# Altium schematic sheet 电源设计.SchDoc
size A4; Organization: Protel International P/L; Address1: L3, 12a Rodborough Rd; Address2: Frenchs Forest; Address3: NSW; Address4: Australia 2086
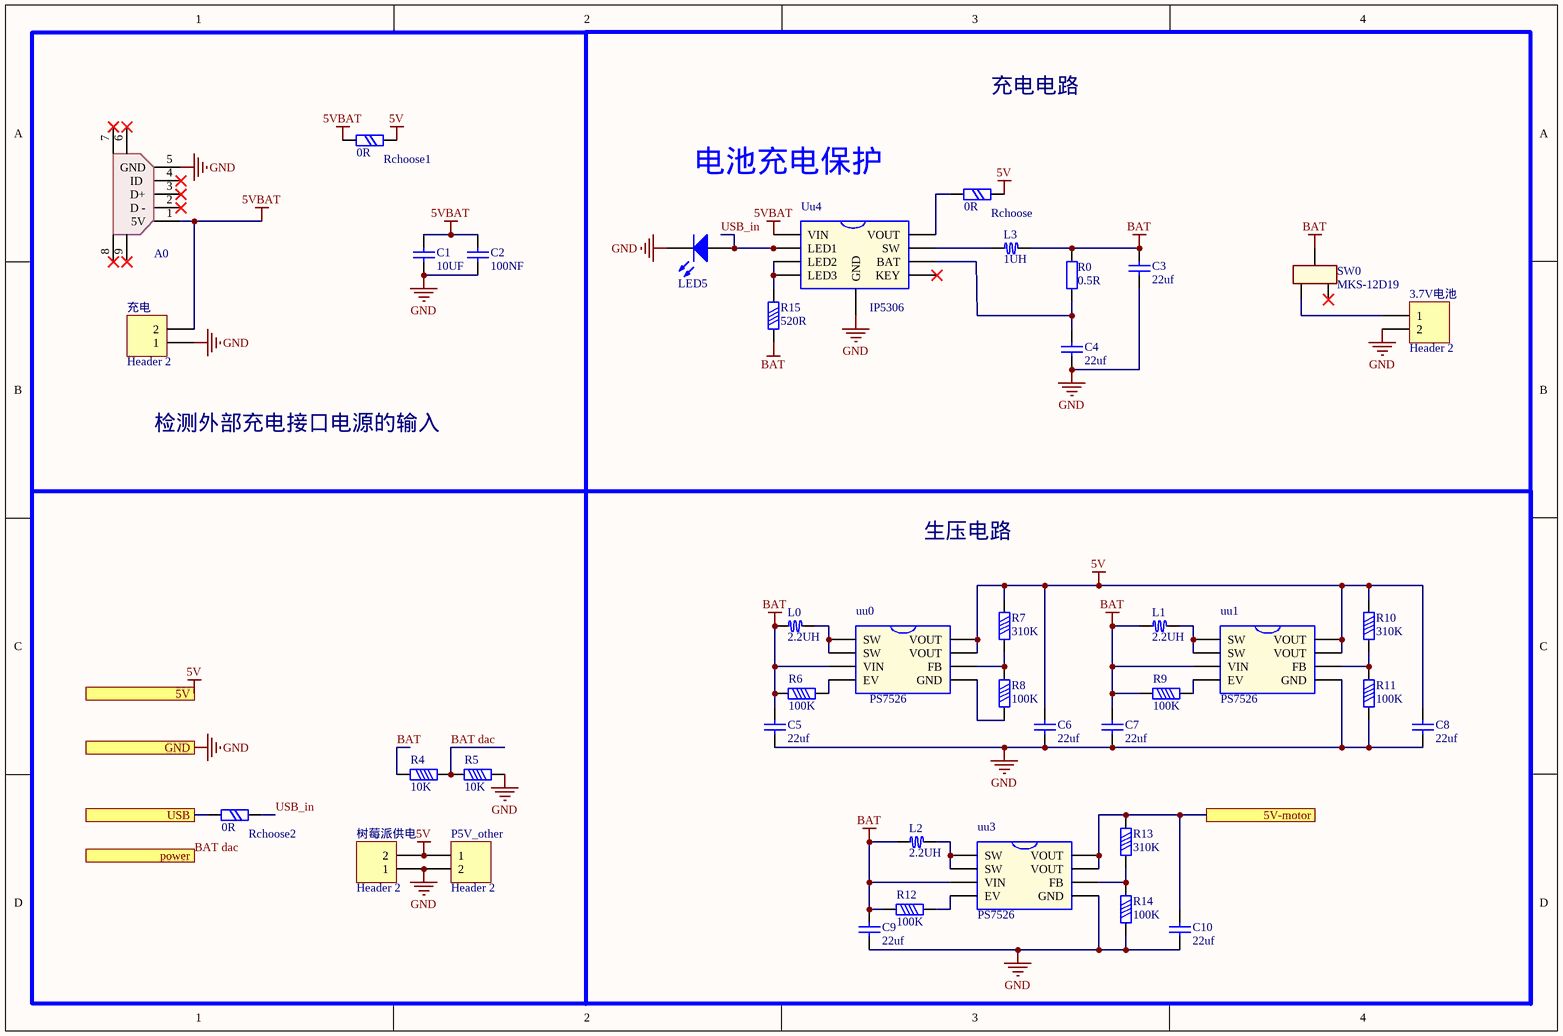
[diagram p0: 电源设计.SchDoc]

## Parts
3.7V电池  Header 2  [HX2.54-2]
A0  Micro USB  [Micro USB]  (value not drawn)
C1  value 10UF  [CC2012-0805]  (hidden comment: Cap Chip 0805)
C2  value 100NF  [CC2012-0805]  (hidden comment: Cap Chip 0805)
C3  value 22uf  [CC2012-0805]  (hidden comment: Cap Chip 0805)
C4  value 22uf  [CC2012-0805]  (hidden comment: Cap Chip 0805)
C5  value 22uf  [CC2012-0805]  (hidden comment: Cap Chip 0805)
C6  value 22uf  [CC2012-0805]  (hidden comment: Cap Chip 0805)
C7  value 22uf  [CC2012-0805]  (hidden comment: Cap Chip 0805)
C8  value 22uf  [CC2012-0805]  (hidden comment: Cap Chip 0805)
C9  value 22uf  [CC2012-0805]  (hidden comment: Cap Chip 0805)
C10  value 22uf  [CC2012-0805]  (hidden comment: Cap Chip 0805)
L0  2.2UH  [Inductor-1040]
L1  2.2UH  [Inductor-1040]
L2  2.2UH  [Inductor-1040]
L3  1UH  [Inductor-1040]
LED5  LED Chip  [CLED1608-0603]  (value not drawn)
P5V_other  Header 2  [HDR1X2]
R0  value 0.5R  [CR2012-0805]  (hidden comment: Resistor Chip 0805)
R4  value 10K  [CR1608-0603]  (hidden comment: Resistor Chip 0603)
R5  value 10K  [CR1608-0603]  (hidden comment: Resistor Chip 0603)
R6  value 100K  [CR1608-0603]  (hidden comment: Resistor Chip 0603)
R7  value 310K  [CR1608-0603]  (hidden comment: Resistor Chip 0603)
R8  value 100K  [CR1608-0603]  (hidden comment: Resistor Chip 0603)
R9  value 100K  [CR1608-0603]  (hidden comment: Resistor Chip 0603)
R10  value 310K  [CR1608-0603]  (hidden comment: Resistor Chip 0603)
R11  value 100K  [CR1608-0603]  (hidden comment: Resistor Chip 0603)
R12  value 100K  [CR1608-0603]  (hidden comment: Resistor Chip 0603)
R13  value 310K  [CR1608-0603]  (hidden comment: Resistor Chip 0603)
R14  value 100K  [CR1608-0603]  (hidden comment: Resistor Chip 0603)
R15  value 520R  [CR1608-0603]  (hidden comment: Resistor Chip 0603)
Rchoose  value 0R  [CR3216-1206]  (hidden comment: Resistor Chip 1206)
Rchoose1  value 0R  [CR3216-1206]  (hidden comment: Resistor Chip 1206)
Rchoose2  value 0R  [CR3216-1206]  (hidden comment: Resistor Chip 1206)
SW0  MKS-12D19  [SW  MKS 12D19]
uu0  PS7526  [ESOP8]
uu1  PS7526  [ESOP8]
uu3  PS7526  [ESOP8]
Uu4  IP5306  [ESOP8]
充电  Header 2  [HX2.54-2]
树莓派供电  Header 2  [HX2.54-2]

## Ports
5V, 5V-motor, GND, power, USB

## Nets
5V: C6.1 C8.1 P5V_other.1 R7.1 R10.1 Rchoose.2 Rchoose1.2 uu0.7(VOUT) uu0.8(VOUT) uu1.7(VOUT) uu1.8(VOUT) 树莓派供电.2 ; port 5V
5VBAT: A0.1(5V) C1.2 C2.2 Rchoose1.1 Uu4.1(VIN) 充电.2
BAT: C3.1 C5.1 C7.1 C9.1 L0.1 L1.1 L2.1 L3.2 R0.1 R4.2 R6.1 R9.1 R12.1 R15.1 SW0.2 uu0.3(VIN) uu1.3(VIN) uu3.3(VIN)
GND: 3.7V电池.2 A0.5(GND) C1.1 C2.1 C3.2 C4.1 C5.2 C6.2 C7.2 C8.2 C9.2 C10.2 LED5.2(K) P5V_other.2 R5.2 R11.2 R14.2 uu1.5(GND) uu3.5(GND) Uu4.9(GND) 充电.1 树莓派供电.1 ; port GND
5V-motor: C10.1 R13.1 uu3.7(VOUT) uu3.8(VOUT) ; port 5V-motor
BAT dac: R4.1 R5.1 ; port power
USB: Rchoose2.1 ; port USB
USB_in: LED5.1(A) Rchoose2.2 Uu4.2(LED1)
Net3.7V电池_1: 3.7V电池.1 SW0.3
NetC4_2: C4.2 R0.2 Uu4.6(BAT)
NetL0_2: L0.2 uu0.1(SW) uu0.2(SW)
NetL1_2: L1.2 uu1.1(SW) uu1.2(SW)
NetL2_2: L2.2 uu3.1(SW) uu3.2(SW)
NetL3_1: L3.1 Uu4.7(SW)
NetR6_2: R6.2 uu0.4(EV)
NetR7_2: R7.2 R8.1 uu0.6(FB)
NetR8_2: R8.2 uu0.5(GND)
NetR9_2: R9.2 uu1.4(EV)
NetR10_2: R10.2 R11.1 uu1.6(FB)
NetR12_2: R12.2 uu3.4(EV)
NetR13_2: R13.2 R14.1 uu3.6(FB)
NetR15_2: R15.2 Uu4.3(LED2) Uu4.4(LED3)
NetRchoose_1: Rchoose.1 Uu4.8(VOUT)

Not connected (* = marked no-connect by the designer): A0 2(D_-)* 3(D+)* 4(ID_)* 6* 7* 8* 9*; SW0 1*; Uu4 5(KEY)

## Notes on the sheet
- 充电电路
- 电池充电保护
- 检测外部充电接口电源的输入
- 生压电路
- Title
- Size:
- Date:
- File:
- A1
- Number:
- Time:
- Revision:
- Sheet
- of

## Library data of the parts
3.7V电池 P5V_other 充电 树莓派供电 = Header 2: Header, 2-Pin; LatestRevisionDate: 17-Jul-2002; LatestRevisionNote: Re-released for DXP Platform.; Publisher: Altium Limited
C1-C10 = Cap Chip 0805: Polarized Capacitor (Radial); Published: 8-Jun-2000; Revision: July-2002: Re-released for DXP Platform.; Publisher: Altium Limited
L0-L3 = Inductor: 圆柱线圈的贴片电感
LED5 = LED Chip: Typical Chip LED; Published: 8-Jun-2000; Revision: July-2002: Re-released for DXP Platform.; Publisher: Altium Limited
R0 = Resistor Chip 0805: Resistor; Published: 8-Jun-2000; Revision: July-2002: Re-released for DXP Platform.; Publisher: Altium Limited
R4-R15 = Resistor Chip 0603: Resistor; Published: 8-Jun-2000; Revision: July-2002: Re-released for DXP Platform.; Publisher: Altium Limited
Rchoose Rchoose1 Rchoose2 = Resistor Chip 1206: Resistor; Published: 8-Jun-2000; Revision: July-2002: Re-released for DXP Platform.; Publisher: Altium Limited
SW0 = sw-MSK-12D19
uu0 uu1 uu3 = PS7526: 3.7V升压输出5V2A/2.4A，(3V,3.3V.3.7V升压输出5V2A/2.4A，PS7526超高效率的同步整流升压方案。实际应用足2.4A。)PS7526超高效率的同步整流升压方案。实际应用足2.4A。
Uu4 = IP5306: 2A的锂电池充电ic,同时具有升压5V输出的功能